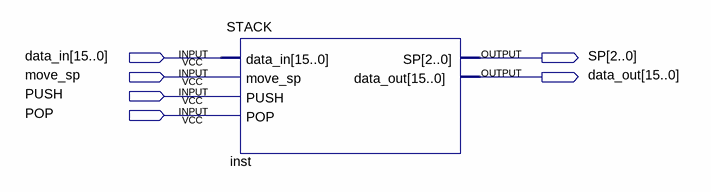
[diagram p0: schematic sheet]
// Quartus schematic STACK_TEST.bdf as structural Verilog: 1 symbols, 6 pins
module STACK_TEST (
  input  [15:0] data_in,
  input  move_sp,
  input  PUSH,
  input  POP,
  output [2:0] SP,
  output [15:0] data_out
);

  STACK inst (.data_in(data_in), .move_sp(move_sp), .PUSH(PUSH), .POP(POP), .SP(SP), .data_out(data_out));
endmodule
